# EAGLE design board (EAGLE 7.7.0)

## Sheet 1 of 2
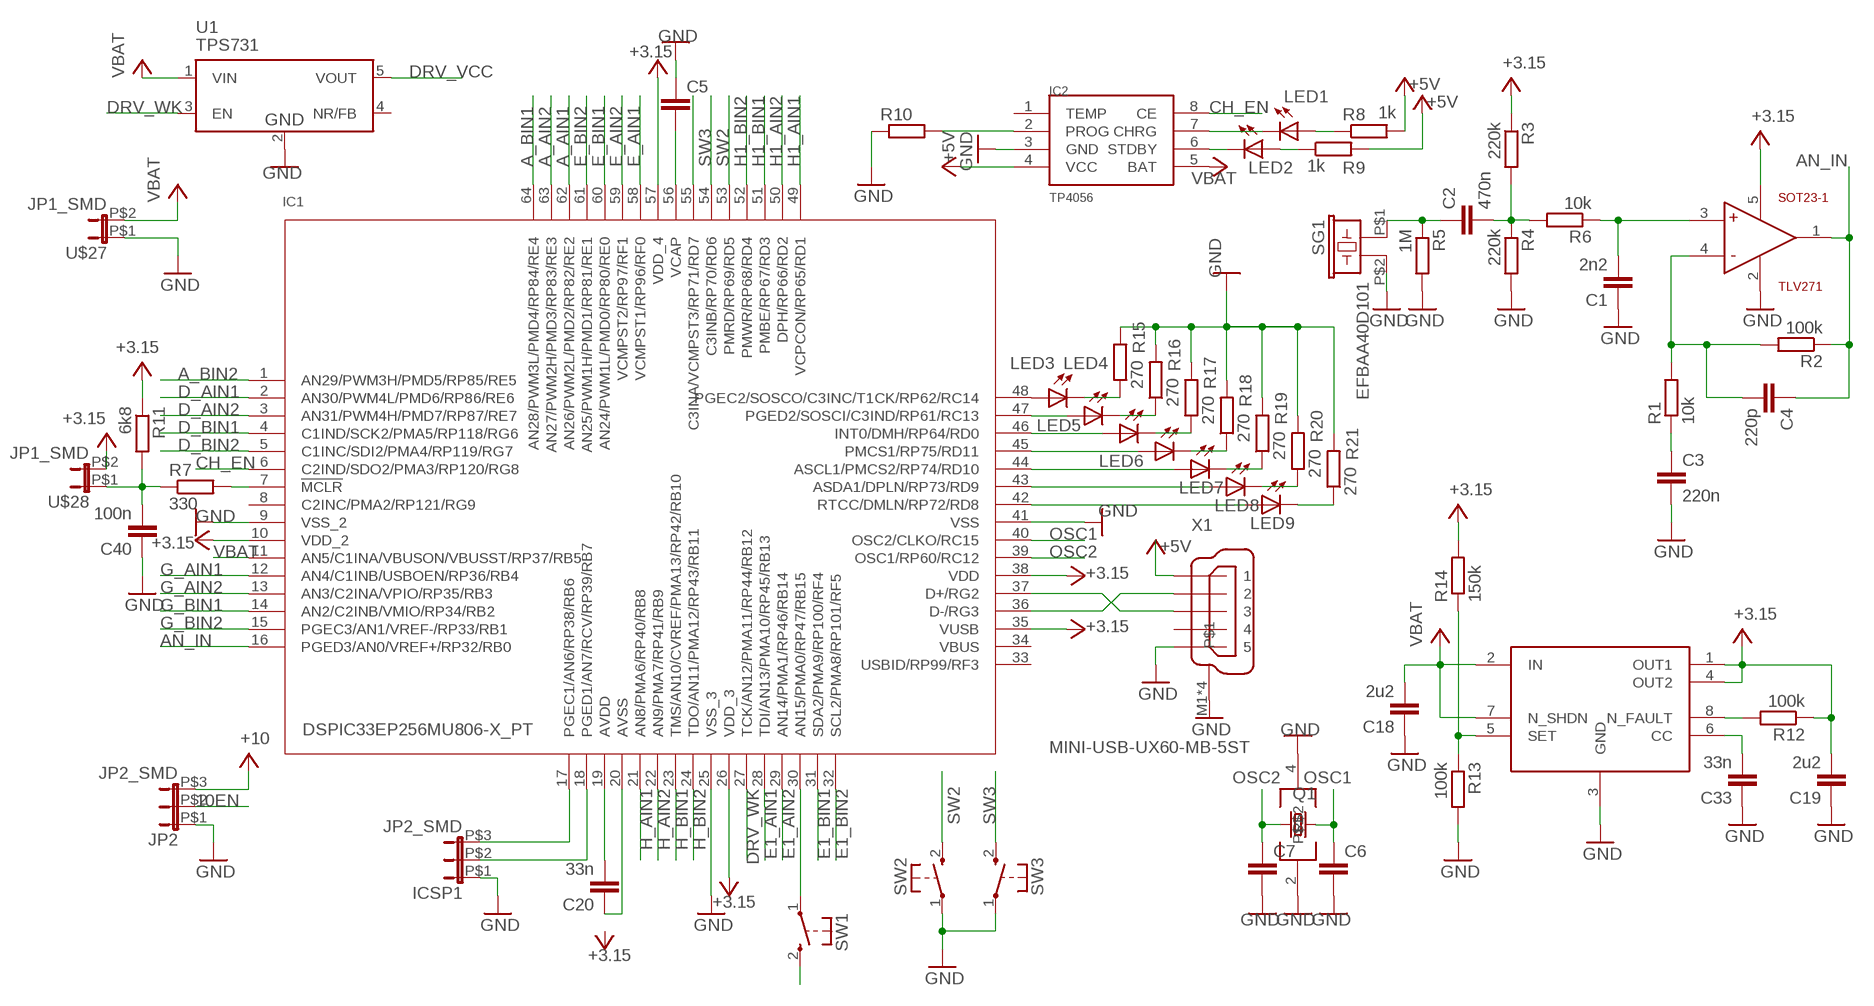
[diagram p0: schematic, sheet 1]

### Parts
C1  2n2  C  [C0805]
C2  470n  C  [C0805]
C3  220n  CC1206  [C1206]
C4  220p  C  [C0805]
C5  CC1206  [C1206]
C6  C  [C0805]
C7  C  [C0805]
C18  2u2  C  [C0805]
C19  2u2  C  [C0805]
C20  33n  C  [C0805]
C33  33n  C  [C0805]
C40  100n  CC0603  [C0603]
IC1  DSPIC33EP256MU806-X_PT  [QFP64-10X10MC]
IC2  TP4056  [SOP-8]
ICSP1  JP2_SMD  [JP2_SMD]
JP2  JP2_SMD  [JP2_SMD]
LED1  LED_ESML0603  [LED_SML0603]
LED2  LED_ESML0603  [LED_SML0603]
LED3  LED_ESML0603  [LED_SML0603]
LED4  LED_ESML0603  [LED_SML0603]
LED5  LED_ESML0603  [LED_SML0603]
LED6  LED_ESML0603  [LED_SML0603]
LED7  LED_ESML0603  [LED_SML0603]
LED8  LED_ESML0603  [LED_SML0603]
LED9  LED_ESML0603  [LED_SML0603]
Q1  CRYSTALCTS406  [CTS406]
R1  10k  R  [R0805]
R2  100k  R  [R0805]
R3  220k  R  [R0805]
R4  220k  R  [R0805]
R5  1M  R  [R0805]
R6  10k  R  [R0805]
R7  330  RR0603  [R0603]
R8  1k  R  [R0805]
R9  1k  R  [R0805]
R10  R  [R0805]
R11  6k8  RR0603  [R0603]
R12  100k  R  [R0805]
R13  100k  R  [R0805]
R14  150k  R  [R0805]
R15  270  R  [R0805]
R16  270  R  [R0805]
R17  270  R  [R0805]
R18  270  R  [R0805]
R19  270  R  [R0805]
R20  270  R  [R0805]
R21  270  R  [R0805]
SG1  EFBAA40D101  [EFBAA40D101]
SOT23-1  TLV271  [SOT23-5]
SW1  KSS-2EG4430  [KSS-2EG4430]
SW2  KSS-2EG4430  [KSS-2EG4430]
SW3  KSS-2EG4430  [KSS-2EG4430]
U1  TPS731  [SOT25]
U$8  LP3982  [LP3982]
U$27  JP1_SMD  [JP1_SMD]
U$28  JP1_SMD  [JP1_SMD]
X1  MINI-USB-UX60-MB-5ST  [UX60-MB-5ST]

### Nets
10EN: IC1.55(C3INA/VCMPST3/RP71/RD7) JP2.P$2
+3.15: R11.1 U$28.P$2
+3.15V: C19.2 IC1.10(VDD_2) IC1.26(VDD_3) IC1.35(VUSB) IC1.38(VDD) IC1.57(VDD_4) R3.1 R12.1 R14.2 SOT23-1.5(VDD) U$8.1(OUT1) U$8.4(OUT2) ; supply symbol labelled +3.15 ; also sheet 2
+5V: IC2.4(VCC) R8.2 R9.2 X1.1 ; also sheet 2
+10V: JP2.P$3 ; supply symbol labelled +10 ; also sheet 2
A_AIN1 [diffPair]: IC1.62(AN26/PWM2L/PMD2/RP82/RE2) ; also sheet 2
A_AIN2 [diffPair]: IC1.63(AN27/PWM2H/PMD3/RP83/RE3) ; also sheet 2
A_BIN1 [diffPair]: IC1.64(AN28/PWM3L/PMD4/RP84/RE4) ; also sheet 2
A_BIN2 [diffPair]: IC1.1(AN29/PWM3H/PMD5/RP85/RE5) ; also sheet 2
AN_IN: C4.1 IC1.16(PGED3/AN0/VREF+/RP32/RB0) R2.1 SOT23-1.1(OUT)
CH_EN: IC1.6(C2IND/SDO2/PMA3/RP120/RG8) IC2.8(CE)
D_AIN1: IC1.2(AN30/PWM4L/PMD6/RP86/RE6) ; also sheet 2
D_AIN2: IC1.3(AN31/PWM4H/PMD7/RP87/RE7) ; also sheet 2
D_BIN1: IC1.4(C1IND/SCK2/PMA5/RP118/RG6) ; also sheet 2
D_BIN2: IC1.5(C1INC/SDI2/PMA4/RP119/RG7) ; also sheet 2
DIFF_NS: IC1.36(D-/RG3) X1.2
DIFF_PD: IC1.37(D+/RG2) X1.3
DRV_VCC: U1.5(VOUT) ; also sheet 2
DRV_WK: IC1.27(TCK/AN12/PMA11/RP44/RB12) U1.3(EN)
E1_AIN1: IC1.28(TDI/AN13/PMA10/RP45/RB13) ; also sheet 2
E1_AIN2: IC1.29(AN14/PMA1/RP46/RB14) ; also sheet 2
E1_BIN1: IC1.31(SDA2/PMA9/RP100/RF4) ; also sheet 2
E1_BIN2: IC1.32(SCL2/PMA8/RP101/RF5) ; also sheet 2
E_AIN1: IC1.58(VCMPST1/RP96/RF0) ; also sheet 2
E_AIN2: IC1.59(VCMPST2/RP97/RF1) ; also sheet 2
E_BIN1: IC1.60(AN24/PWM1L/PMD0/RP80/RE0) ; also sheet 2
E_BIN2: IC1.61(AN25/PWM1H/PMD1/RP81/RE1) ; also sheet 2
FGH [diffPair]: IC1.17(PGEC1/AN6/RP38/RB6) ICSP1.P$3
G_AIN1: IC1.12(AN4/C1INB/USBOEN/RP36/RB4) ; also sheet 2
G_AIN2: IC1.13(AN3/C2INA/VPIO/RP35/RB3) ; also sheet 2
G_BIN1: IC1.14(AN2/C2INB/VMIO/RP34/RB2) ; also sheet 2
G_BIN2: IC1.15(PGEC3/AN1/VREF-/RP33/RB1) ; also sheet 2
GFD [diffPair]: IC1.18(PGED1/AN7/RCV/RP39/RB7) ICSP1.P$2
GND: C1.1 C3.2 C5.1 C6.2 C7.2 C18.1 C19.1 C33.1 C40.1 IC1.9(VSS_2) IC1.25(VSS_3) IC1.41(VSS) IC2.3(GND) ICSP1.P$1 JP2.P$1 Q1.2 Q1.4 R4.2 R5.2 R10.1 R13.2 R15.2 R16.2 R17.2 R18.2 R19.2 R20.2 R21.2 SG1.P$2 SOT23-1.2(GND) SW2.1(P) SW3.1(P) U1.2(GND) U$8.3(GND) U$27.P$1 X1.5 X1.M1 X1.M2 X1.M3 X1.M4 ; also sheet 2
H1_AIN1: IC1.49(VCPCON/RP65/RD1) ; also sheet 2
H1_AIN2: IC1.50(DPH/RP66/RD2) ; also sheet 2
H1_BIN1: IC1.51(PMBE/RP67/RD3) ; also sheet 2
H1_BIN2: IC1.52(PMWR/RP68/RD4) ; also sheet 2
H_AIN1: IC1.21(AN8/PMA6/RP40/RB8) ; also sheet 2
H_AIN2: IC1.22(AN9/PMA7/RP41/RB9) ; also sheet 2
H_BIN1: IC1.23(TMS/AN10/CVREF/PMA13/RP42/RB10) ; also sheet 2
H_BIN2: IC1.24(TDO/AN11/PMA12/RP43/RB11) ; also sheet 2
N$1: SW1.2(S)
N$3: C20.2 IC1.19(AVDD)
N$4: C20.1 IC1.20(AVSS)
N$5: IC1.7(!MCLR) R7.2
N$6: C5.2 IC1.56(VCAP)
N$11: IC1.48(PGEC2/SOSCO/C3INC/T1CK/RP62/RC14) LED3.A
N$12: C4.2 R1.2 R2.2 SOT23-1.4(IN-)
N$13: C3.1 R1.1
N$14: C2.2 R3.2 R4.1 R6.2
N$15: IC2.7(CHRG) LED1.C
N$16: C2.1 R5.1 SG1.P$1
N$21: IC2.6(STDBY) LED2.C
N$22: LED2.A R9.1
N$23: LED1.A R8.1
N$24: IC2.2(PROG) R10.2
N$25: C1.2 R6.1 SOT23-1.3(IN+)
N$26: R12.2 U$8.8(N_FAULT)
N$31: C33.2 U$8.6(CC)
N$32: IC1.47(PGED2/SOSCI/C3IND/RP61/RC13) LED4.A
N$33: R13.1 R14.1 U$8.5(SET)
N$34: IC1.46(INT0/DMH/RP64/RD0) LED5.A
N$42: IC1.45(PMCS1/RP75/RD11) LED6.A
N$43: IC1.44(ASCL1/PMCS2/RP74/RD10) LED7.A
N$44: IC1.43(ASDA1/DPLN/RP73/RD9) LED8.A
N$45: IC1.42(RTCC/DMLN/RP72/RD8) LED9.A
N$46: LED9.C R21.1
N$51: LED8.C R20.1
N$52: LED7.C R19.1
N$53: LED6.C R18.1
N$54: LED5.C R17.1
N$55: LED4.C R16.1
N$56: LED3.C R15.1
N$62: IC1.30(AN15/PMA0/RP47/RB15) SW1.1(P)
OSC1: C6.1 IC1.40(OSC2/CLKO/RC15) Q1.1
OSC2: C7.1 IC1.39(OSC1/RP60/RC12) Q1.3
RST: C40.2 R7.1 R11.2 U$28.P$1
SW2: IC1.53(PMRD/RP69/RD5) SW2.2(S)
SW3: IC1.54(C3INB/RP70/RD6) SW3.2(S)
VBAT: C18.2 IC1.11(AN5/C1INA/VBUSON/VBUSST/RP37/RB5) IC2.5(BAT) U1.1(VIN) U$8.2(IN) U$8.7(N_SHDN) U$27.P$2 ; also sheet 2
Unconnected: IC1.8(C2INC/PMA2/RP121/RG9) IC1.33(USBID/RP99/RF3) IC2.1(TEMP) U1.4(NR/FB) X1.4

## Sheet 2 of 2
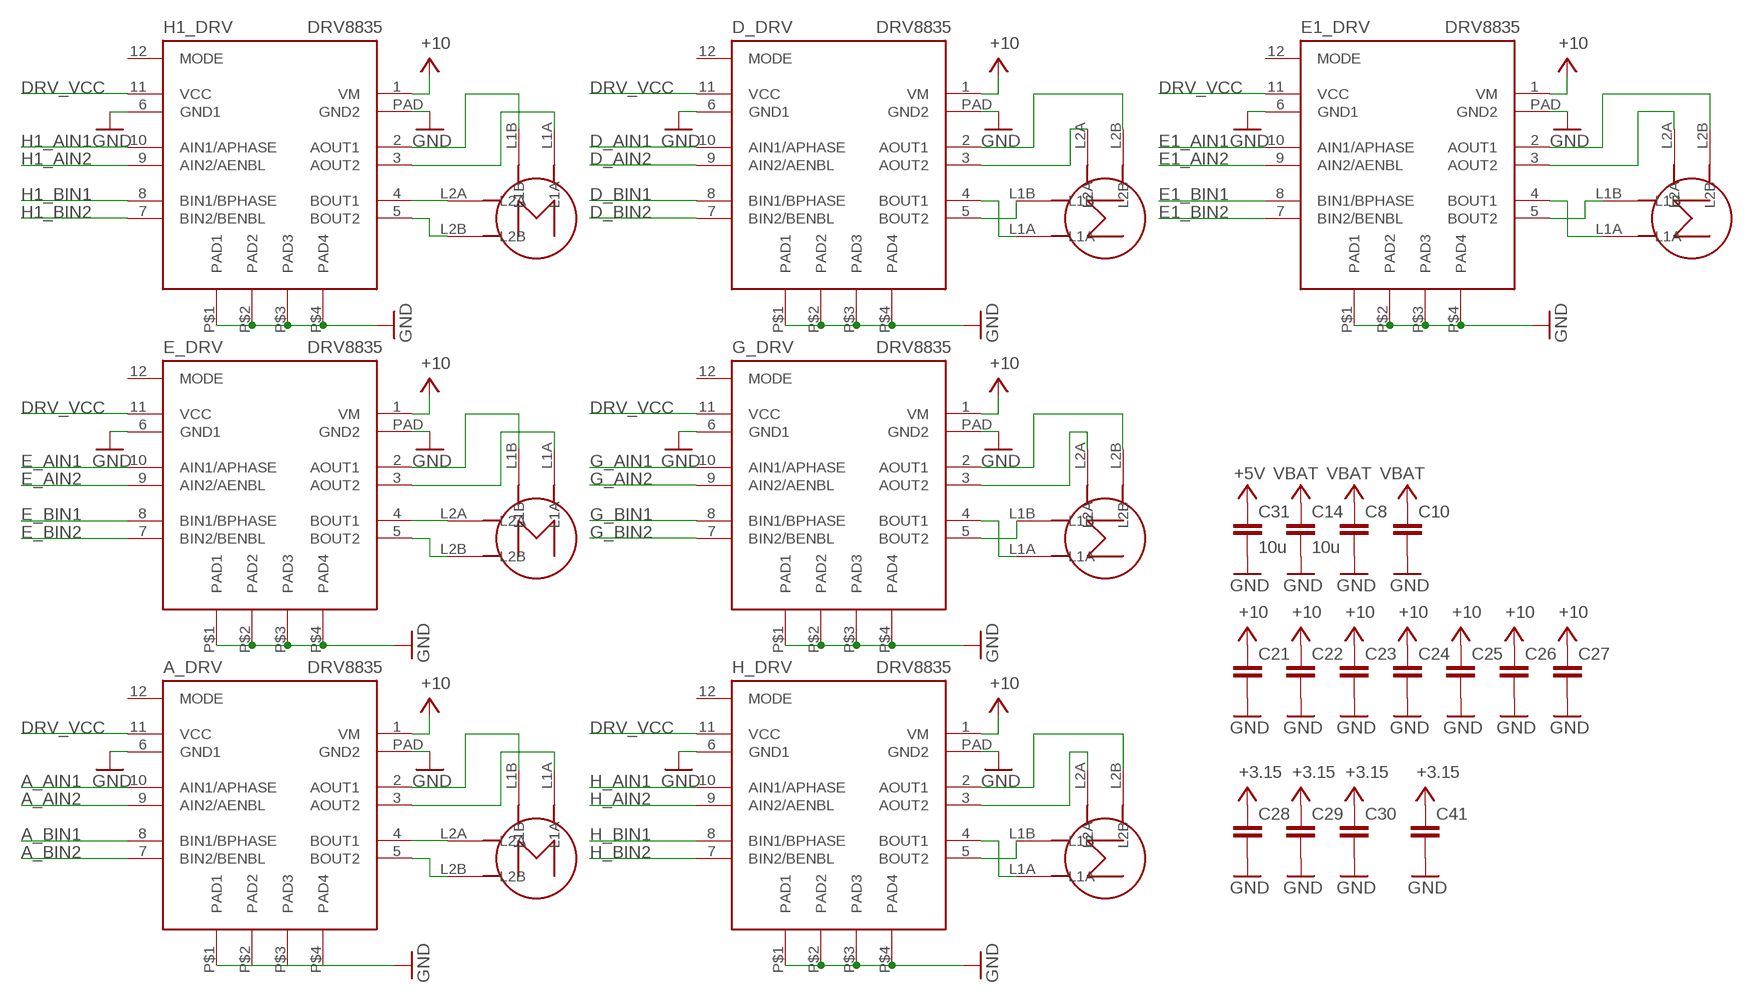
[diagram p1: schematic, sheet 2]

### Parts
A_DRV  DRV8835  [WSON_2X3]
C8  CC1206  [C1206]
C10  CC1206  [C1206]
C14  10u  CC1206  [C1206]
C21  CC1206  [C1206]
C22  CC1206  [C1206]
C23  CC1206  [C1206]
C24  CC1206  [C1206]
C25  CC1206  [C1206]
C26  CC1206  [C1206]
C27  CC1206  [C1206]
C28  CC1206  [C1206]
C29  CC1206  [C1206]
C30  CC1206  [C1206]
C31  10u  CC1206  [C1206]
C41  CC1206  [C1206]
D_DRV  DRV8835  [WSON_2X3]
E1_DRV  DRV8835  [WSON_2X3]
E_DRV  DRV8835  [WSON_2X3]
G_DRV  DRV8835  [WSON_2X3]
H1_DRV  DRV8835  [WSON_2X3]
H1šWF  H1  STEP_MOTOR  [STEP_MOTOR]
H_DRV  DRV8835  [WSON_2X3]
U$1  STEP_MOTOR_MIRROR  [STEP_MOTOR_MIRROR]
U$2  STEP_MOTOR_MIRROR  [STEP_MOTOR_MIRROR]
U$3  STEP_MOTOR_MIRROR  [STEP_MOTOR_MIRROR]
U$4  STEP_MOTOR  [STEP_MOTOR]
U$6  STEP_MOTOR  [STEP_MOTOR]
U$7  STEP_MOTOR_MIRROR  [STEP_MOTOR_MIRROR]

### Nets
+3.15V: C28.1 C29.1 C30.1 C41.1 ; supply symbol labelled +3.15 ; also sheet 1
+5V: C31.1 ; also sheet 1
+10V: A_DRV.1(VM) C21.1 C22.1 C23.1 C24.1 C25.1 C26.1 C27.1 D_DRV.1(VM) E1_DRV.1(VM) E_DRV.1(VM) G_DRV.1(VM) H1_DRV.1(VM) H_DRV.1(VM) ; supply symbol labelled +10 ; also sheet 1
A_AIN1 [diffPair]: A_DRV.10(AIN1/APHASE) ; also sheet 1
A_AIN2 [diffPair]: A_DRV.9(AIN2/AENBL) ; also sheet 1
A_BIN1 [diffPair]: A_DRV.8(BIN1/BPHASE) ; also sheet 1
A_BIN2 [diffPair]: A_DRV.7(BIN2/BENBL) ; also sheet 1
D_AIN1: D_DRV.10(AIN1/APHASE) ; also sheet 1
D_AIN2: D_DRV.9(AIN2/AENBL) ; also sheet 1
D_BIN1: D_DRV.8(BIN1/BPHASE) ; also sheet 1
D_BIN2: D_DRV.7(BIN2/BENBL) ; also sheet 1
DRV_VCC: A_DRV.11(VCC) D_DRV.11(VCC) E1_DRV.11(VCC) E_DRV.11(VCC) G_DRV.11(VCC) H1_DRV.11(VCC) H_DRV.11(VCC) ; also sheet 1
E1_AIN1: E1_DRV.10(AIN1/APHASE) ; also sheet 1
E1_AIN2: E1_DRV.9(AIN2/AENBL) ; also sheet 1
E1_BIN1: E1_DRV.8(BIN1/BPHASE) ; also sheet 1
E1_BIN2: E1_DRV.7(BIN2/BENBL) ; also sheet 1
E_AIN1: E_DRV.10(AIN1/APHASE) ; also sheet 1
E_AIN2: E_DRV.9(AIN2/AENBL) ; also sheet 1
E_BIN1: E_DRV.8(BIN1/BPHASE) ; also sheet 1
E_BIN2: E_DRV.7(BIN2/BENBL) ; also sheet 1
G_AIN1: G_DRV.10(AIN1/APHASE) ; also sheet 1
G_AIN2: G_DRV.9(AIN2/AENBL) ; also sheet 1
G_BIN1: G_DRV.8(BIN1/BPHASE) ; also sheet 1
G_BIN2: G_DRV.7(BIN2/BENBL) ; also sheet 1
GND: A_DRV.6(GND1) A_DRV.P$1(PAD1) A_DRV.PAD(GND2) C8.2 C10.2 C14.2 C21.2 C22.2 C23.2 C24.2 C25.2 C26.2 C27.2 C28.2 C29.2 C30.2 C31.2 C41.2 D_DRV.6(GND1) D_DRV.P$1(PAD1) D_DRV.P$2(PAD2) D_DRV.P$3(PAD3) D_DRV.P$4(PAD4) D_DRV.PAD(GND2) E1_DRV.6(GND1) E1_DRV.P$1(PAD1) E1_DRV.P$2(PAD2) E1_DRV.P$3(PAD3) E1_DRV.P$4(PAD4) E1_DRV.PAD(GND2) E_DRV.6(GND1) E_DRV.P$1(PAD1) E_DRV.P$2(PAD2) E_DRV.P$3(PAD3) E_DRV.P$4(PAD4) E_DRV.PAD(GND2) G_DRV.6(GND1) G_DRV.P$1(PAD1) G_DRV.P$2(PAD2) G_DRV.P$3(PAD3) G_DRV.P$4(PAD4) G_DRV.PAD(GND2) H1_DRV.6(GND1) H1_DRV.P$1(PAD1) H1_DRV.P$2(PAD2) H1_DRV.P$3(PAD3) H1_DRV.P$4(PAD4) H1_DRV.PAD(GND2) H_DRV.6(GND1) H_DRV.P$1(PAD1) H_DRV.P$2(PAD2) H_DRV.P$3(PAD3) H_DRV.P$4(PAD4) H_DRV.PAD(GND2) ; also sheet 1
H1_AIN1: H1_DRV.10(AIN1/APHASE) ; also sheet 1
H1_AIN2: H1_DRV.9(AIN2/AENBL) ; also sheet 1
H1_BIN1: H1_DRV.8(BIN1/BPHASE) ; also sheet 1
H1_BIN2: H1_DRV.7(BIN2/BENBL) ; also sheet 1
H_AIN1: H_DRV.10(AIN1/APHASE) ; also sheet 1
H_AIN2: H_DRV.9(AIN2/AENBL) ; also sheet 1
H_BIN1: H_DRV.8(BIN1/BPHASE) ; also sheet 1
H_BIN2: H_DRV.7(BIN2/BENBL) ; also sheet 1
N$7: D_DRV.2(AOUT1) U$2.L2B
N$8: D_DRV.3(AOUT2) U$2.L2A
N$9: D_DRV.5(BOUT2) U$2.L1B
N$10: D_DRV.4(BOUT1) U$2.L1A
N$17: E1_DRV.2(AOUT1) U$1.L2B
N$18: E1_DRV.3(AOUT2) U$1.L2A
N$19: E1_DRV.4(BOUT1) U$1.L1A
N$20: E1_DRV.5(BOUT2) U$1.L1B
N$27: G_DRV.2(AOUT1) U$3.L2B
N$28: G_DRV.3(AOUT2) U$3.L2A
N$29: G_DRV.5(BOUT2) U$3.L1B
N$30: G_DRV.4(BOUT1) U$3.L1A
N$35: E_DRV.5(BOUT2) U$4.L2B
N$36: H_DRV.4(BOUT1) U$7.L1A
N$37: E_DRV.2(AOUT1) U$4.L1B
N$38: E_DRV.3(AOUT2) U$4.L1A
N$40: E_DRV.4(BOUT1) U$4.L2A
N$41: A_DRV.5(BOUT2) U$6.L2B
N$47: H1_DRV.2(AOUT1) H1šWF.L1B
N$48: H1_DRV.3(AOUT2) H1šWF.L1A
N$49: H1_DRV.5(BOUT2) H1šWF.L2B
N$50: H1_DRV.4(BOUT1) H1šWF.L2A
N$57: A_DRV.2(AOUT1) U$6.L1B
N$58: A_DRV.3(AOUT2) U$6.L1A
N$60: A_DRV.4(BOUT1) U$6.L2A
N$67: H_DRV.2(AOUT1) U$7.L2B
N$68: H_DRV.3(AOUT2) U$7.L2A
N$69: H_DRV.5(BOUT2) U$7.L1B
VBAT: C8.1 C10.1 C14.1 ; also sheet 1
Unconnected: A_DRV.12(MODE) A_DRV.P$2(PAD2) A_DRV.P$3(PAD3) A_DRV.P$4(PAD4) D_DRV.12(MODE) E1_DRV.12(MODE) E_DRV.12(MODE) G_DRV.12(MODE) H1_DRV.12(MODE) H_DRV.12(MODE)

## Power pins joined to a net without a drawn wire
VBUS: IC1.34(VBUS)

## Library data of the parts
A_DRV D_DRV E1_DRV E_DRV G_DRV H1_DRV H_DRV = bt_motordriver:DRV8835: DRV8835 DUAL LOW VOLTAGE H-BRIDGE IC The DRV8835 provides an integrated motor driver solution for cameras, consumer products, toys, and other low voltage or battery-powered motion control applications. The device has two H-bridge drivers, and can drive two DC motors or one stepper motor, as well as other devices like solenoids. The device has two H-bridge drivers, and drives two DC motors or one stepper motor, as well as other devices like solenoids. The output driver block for each consists of N-channel power MOSFETs configured as an H-bridge to drive the motor winding. An internal charge pump generates gate drive voltages. 1.5-A Maximum Drive Current Per H-Bridge Configure Bridges Parallel for 3-A Drive Curren 0-V to 11-V Motor-Operating Supply-Voltage 2-V to 7-V Logic Supply-Voltage Flexible PWM or PHASE/ENABLE Interface Low-Power Sleep Mode With 95-nA Maximum Supply Current Tiny 2.00-mm × 3.00-mm WSON Package Reference: http://www.ti.com/lit/ds/symlink/drv8835.pdf
C1-C8 C10 C14 C18-C31 C33 C40 C41 = eagle-ltspice:C: CAPACITOR, European symbol; SPICEMODEL: NONE; SPICEPREFIX: C
H1šWF U$4 U$6 = diplomka:STEP_MOTOR
IC1 = dspic33ep:DSPIC33EP256MU806-X_PT: dsPIC33EP256MU806-X_PT QFP64 10x10
IC2 = TP4056.lbr:TP4056
ICSP1 JP2 = jumper:JP2_SMD
LED1-LED9 = eagle-ltspice:LED_E: LED Source: http://www.osram.convergy.de Source: www.luxeon.com Source: www.kingbright.com; SPICEMODEL: NONE; SPICEPREFIX: D; SPICETYPE: diode
Q1 = crystal:CRYSTAL: CRYSTAL; OC_FARNELL: unknown; OC_NEWARK: unknown
R1-R21 = eagle-ltspice:R: RESISTOR, European symbol; SPICEMODEL: NONE; SPICEPREFIX: R
SG1 = buzzer:EFB?: Piezoelectric Acoustic Transducer Source: Panbasonic .. 2SC1685.pdf; OC_FARNELL: unknown; OC_NEWARK: unknown
SOT23-1 = texas_instruments:TLV271: TLV271 Single channel 3mhz Op-Amp
SW1-SW3 = buttons:KSS-2EG4430: Size: 3x6mm Height: 5mm from PCB Rating: DC12v 50mA Travel: 0.25±0.10mm Operating Force: 180±50gf Return Force: 60gf min Contact resistance: 100m? max Insulation resistance: 100M? min Operating life?50,000 cycles
U1 = TPS731xx:TPS731*
U$1-U$3 U$7 = diplomka:STEP_MOTOR_MIRROR
U$8 = diplomka2:LP3982
U$27 U$28 = jumper:JP1_SMD
X1 = con-hirose:MINI-USB-: MINI USB Connector Source: http://www.hirose.co.jp/cataloge_hp/e24000019.pdf; OC_FARNELL: unknown; OC_NEWARK: unknown

## Net classes
0 default: width 0.15 mm, drill 0.3 mm, clearance 0.15 mm
1 diffPair: width 0.15 mm, drill 0.3 mm, clearance 0.15 mm

## Board
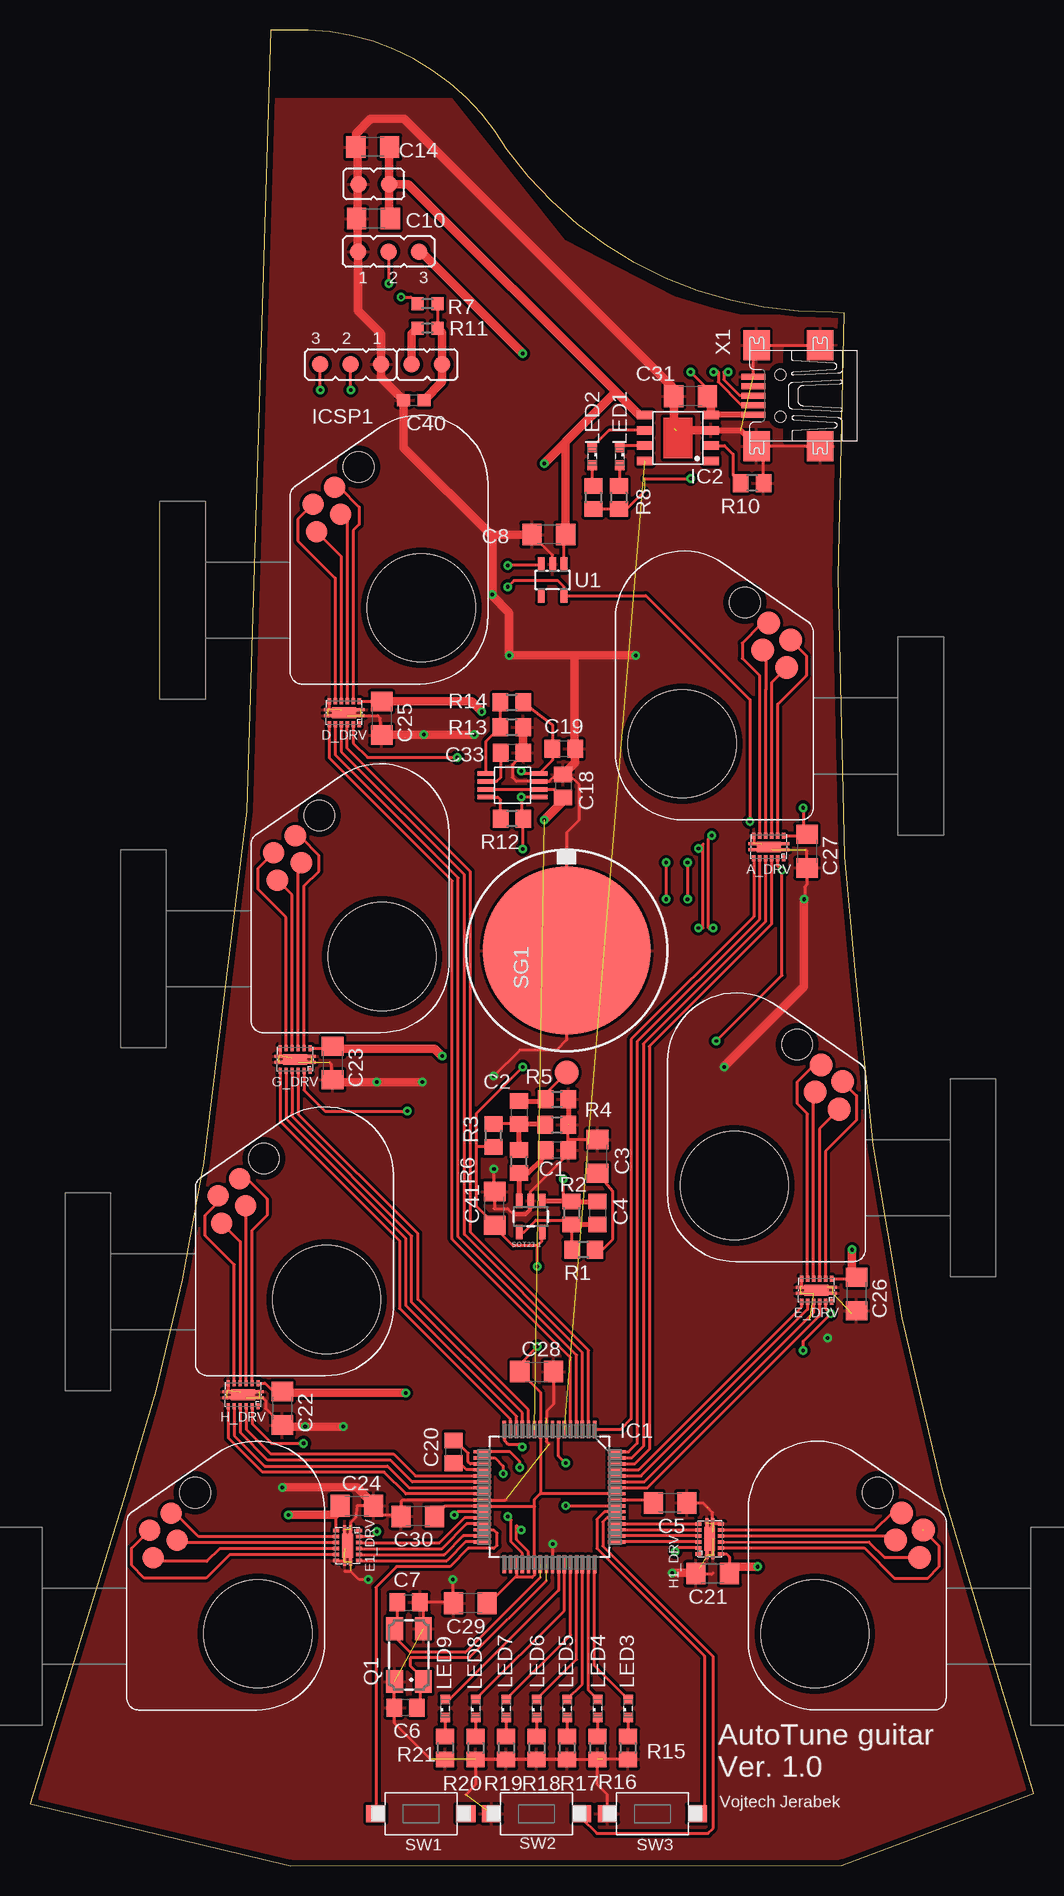
[diagram p2: board, top side]
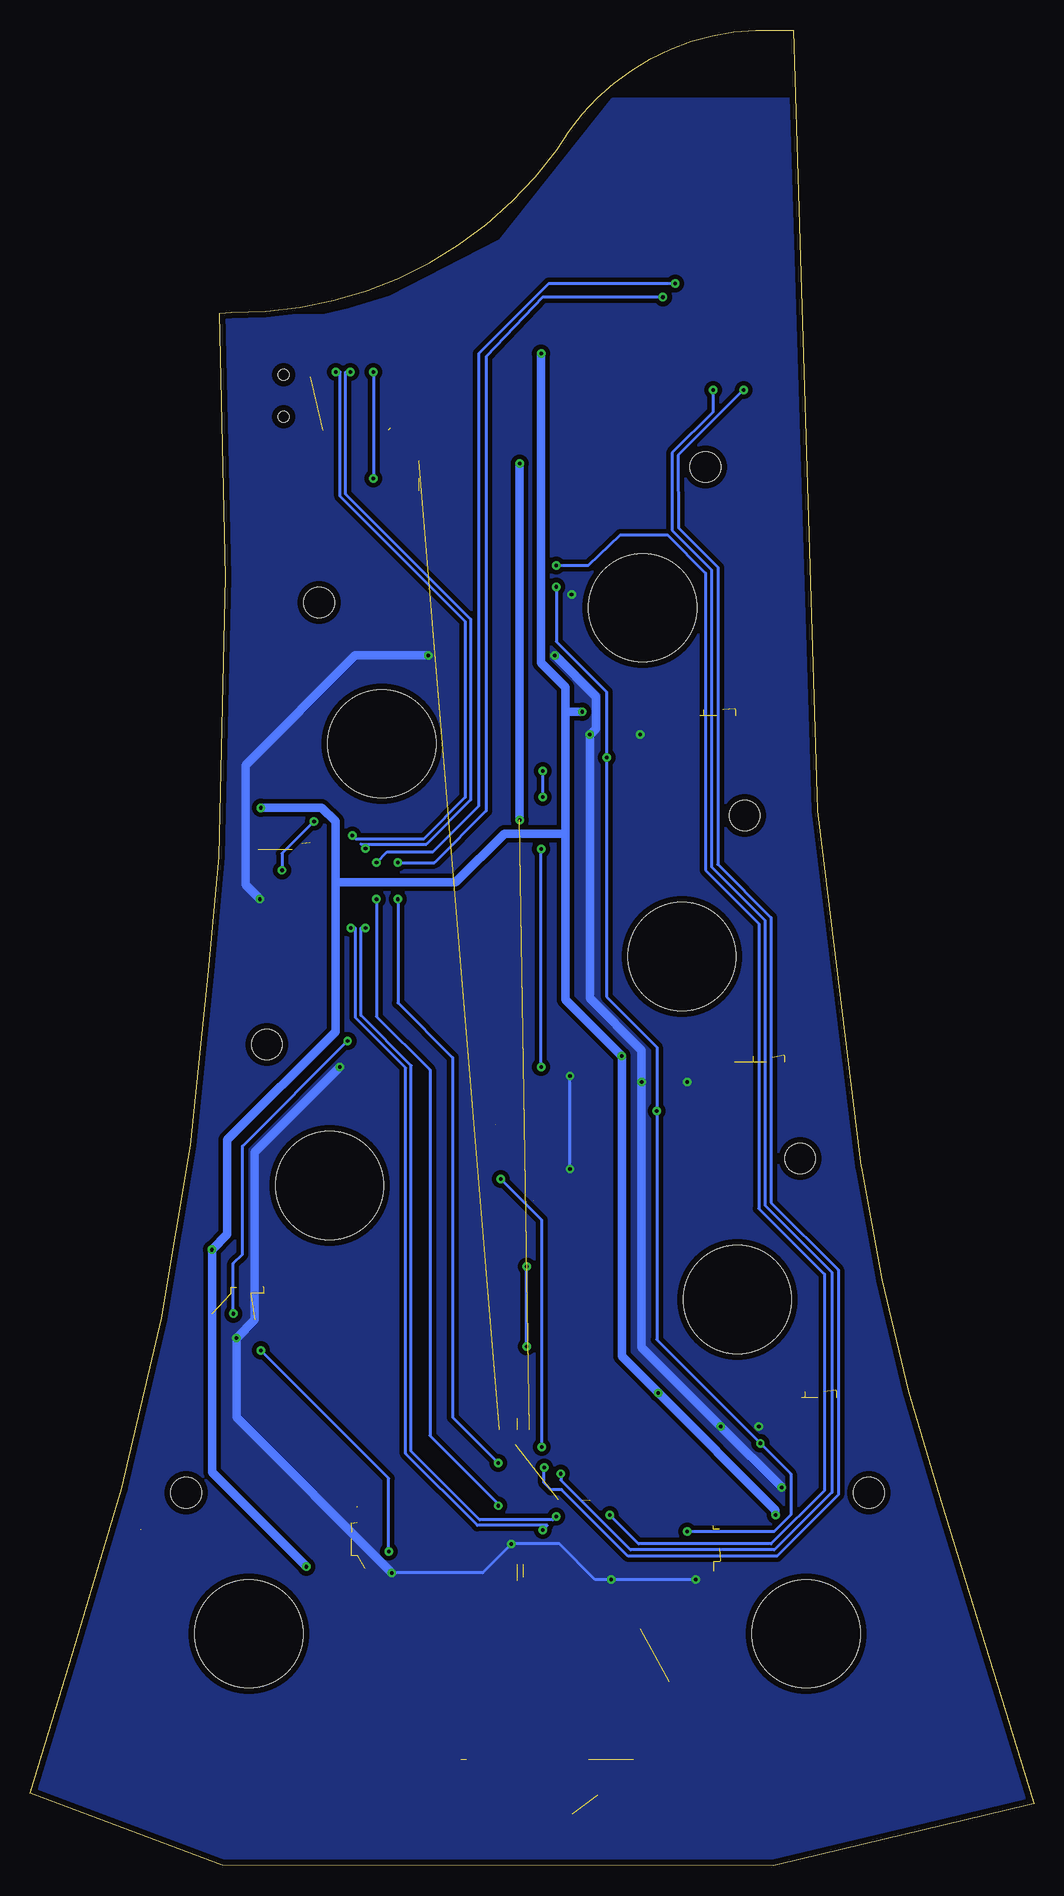
[diagram p3: board, bottom side, seen from below]

Size 83.71 x 152.97 mm. Coordinates in mm from the lower left corner, seen from the top.
Outline: 0,5.14 21.71,0 67.7,0.05 83.7,6.02 83.71,6.02 80.24,17.4 arc-14 68.83,74.56 67.95,84.08 67.41,107.43 67.9,129.36 66.92,129.46 arc-55 39.76,143.01 arc63 21.36,152.96 20.06,152.94 18.06,87.9 14.42,58.28 14.39,58.22 arc-9 7.77,30.39 0.01,5.2 0,5.14
Copper layers (1*16): Top 0.035mm / dielectric 1.5mm / Bottom 0.035mm
Design rules "default *": minimum track width 10mil, minimum drill 10mil, track to track 0.15mm, track to pad 0.15mm, pad to pad 0.15mm, via to via 0.15mm, smd to smd 0.15mm, copper to edge 20mil, drill to drill 8mil, minimum pad ring 10mil, minimum via ring 8mil, stop-mask expansion 2mil, vias tented up to drill 15mil, thermal gap 10mil

### Footprints (pad centres in the part's own frame; a part is rotated, then mirrored left to right if it is on the bottom)
WSON_2X3 = smd 0.28 x 0.5: 1 -1.25,-0.95; 2 -0.75,-0.95; 3 -0.25,-0.95; 4 0.25,-0.95; 5 0.75,-0.95; 6 1.25,-0.95; 7 1.25,0.95; 8 0.75,0.95; 9 0.25,0.95; 10 -0.25,0.95; 11 -0.75,0.95; 12 -1.25,0.95 | smd 0.7 x 0.25: P$1 -1.35,0.25; P$2 -1.35,-0.25; P$3 1.35,-0.25; P$4 1.35,0.25 | smd 2 x 0.9: PAD 0,0
C0805 = smd 1.3 x 1.5: 1 -0.95,0; 2 0.95,0
C1206 = smd 1.6 x 1.8: 1 -1.4,0; 2 1.4,0
C0603 = smd 1.1 x 1: 1 -0.85,0; 2 0.85,0
STEP_MOTOR = smd 1.93 x 1.93: L1A 6.35,-8.73; L1B 8.65,-9.03; L2A 7.8,-6.73; L2B 10.05,-7.23 | hole 9: 0,0 | hole 2.54: 11.75,-5.23
QFP64-10X10MC = smd 1.473 x 0.279: 1 -5.613,3.759; 2 -5.613,3.251; 3 -5.613,2.743; 4 -5.613,2.261; 5 -5.613,1.753; 6 -5.613,1.245; 7 -5.613,0.762; 8 -5.613,0.254; 9 -5.613,-0.254; 10 -5.613,-0.762; 11 -5.613,-1.245; 12 -5.613,-1.753; 13 -5.613,-2.261; 14 -5.613,-2.743; 15 -5.613,-3.251; 16 -5.613,-3.759; 33 5.613,-3.759; 34 5.613,-3.251; 35 5.613,-2.743; 36 5.613,-2.261; 37 5.613,-1.753; 38 5.613,-1.245; 39 5.613,-0.762; 40 5.613,-0.254; 41 5.613,0.254; 42 5.613,0.762; 43 5.613,1.245; 44 5.613,1.753; 45 5.613,2.261; 46 5.613,2.743; 47 5.613,3.251; 48 5.613,3.759 | smd 0.279 x 1.473: 17 -3.759,-5.613; 18 -3.251,-5.613; 19 -2.743,-5.613; 20 -2.261,-5.613; 21 -1.753,-5.613; 22 -1.245,-5.613; 23 -0.762,-5.613; 24 -0.254,-5.613; 25 0.254,-5.613; 26 0.762,-5.613; 27 1.245,-5.613; 28 1.753,-5.613; 29 2.261,-5.613; 30 2.743,-5.613; 31 3.251,-5.613; 32 3.759,-5.613; 49 3.759,5.613; 50 3.251,5.613; 51 2.743,5.613; 52 2.261,5.613; 53 1.753,5.613; 54 1.245,5.613; 55 0.762,5.613; 56 0.254,5.613; 57 -0.254,5.613; 58 -0.762,5.613; 59 -1.245,5.613; 60 -1.753,5.613; 61 -2.261,5.613; 62 -2.743,5.613; 63 -3.251,5.613; 64 -3.759,5.613
SOP-8 = smd 1.3 x 0.7: 1 -2.75,1.905; 2 -2.75,0.635; 3 -2.75,-0.635; 4 -2.75,-1.905; 5 2.75,-1.905; 6 2.75,-0.635; 7 2.75,0.635; 8 2.75,1.905
JP2_SMD = smd 1.397 x 1.397: P$1 -2.54,0; P$2 0,0; P$3 2.54,0
LED_SML0603 = smd 0.8 x 0.8: A 0.75,0; C -0.75,0
CTS406 = smd 1.9 x 1.4: 1 -2.2,-1.2; 2 2.2,-1.2; 3 2.2,1.2; 4 -2.2,1.2
R0805 = smd 1.3 x 1.5: 1 -0.95,0; 2 0.95,0
R0603 = smd 1 x 1.1: 1 -0.85,0; 2 0.85,0
EFBAA40D101 = smd 2 x 2: P$1 -10.16,0 | smd 14 x 14: P$2 0,0
SOT23-5 = smd 0.55 x 1.2: 1 0.32,1.24; 2 1.27,1.24; 3 2.22,1.24; 4 2.22,3.84; 5 0.32,3.84
KSS-2EG4430 = smd 1.6 x 1.4: 1 -3.75,0; 2 3.75,0
SOT25 = smd 0.55 x 1.2: 1 -0.95,-1.3; 2 0,-1.3; 3 0.95,-1.3; 4 0.95,1.3; 5 -0.95,1.3
STEP_MOTOR_MIRROR = smd 1.778 x 1.778: L1A -6.35,-8.73; L1B -8.65,-9.03; L2A -7.8,-6.73; L2B -10.05,-7.23 | hole 2.54: -11.75,-5.23 | hole 9: 0,0
LP3982 = smd 1.45 x 0.38: 1 -2.2,0.975; 2 -2.2,0.325; 3 -2.2,-0.325; 4 -2.2,-0.975; 5 2.2,-0.975; 6 2.2,-0.325; 7 2.2,0.325; 8 2.2,0.975
JP1_SMD = smd 1.397 x 1.397: P$1 0,-1.27; P$2 0,1.27
UX60-MB-5ST = smd 2 x 0.5: 1 2.25,1.6; 2 2.25,0.8; 3 2.25,0; 4 2.25,-0.8; 5 2.25,-1.6 | smd 2.2 x 2.5: M1 -3.3,-4.2; M2 -3.3,4.2; M3 2,4.2; M4 2,-4.2 | hole 0.9: 0,-1.75; 0,1.75

### Placement (x,y rotation side)
A_DRV  61.6,84.89 180 top
C1  43.94,59.62 180 top
C2  40.78,62.76 270 top
C3  47.31,59.11 90 top
C4  47.3,54.39 270 top
C5  53.37,30.23 180 top
C6  31.31,13.17 180 top
C7  31.56,21.93 0 top
C8  43.26,110.93 180 top
C10  28.64,137.25 180 top
C14  28.57,143.22 180 top
C18  44.45,89.97 270 top
C19  44.5,93.06 180 top
C20  35.33,34.48 90 top
C21  56.91,24.34 180 top
C22  21.03,38.12 270 top
C23  25.23,66.89 270 top
C24  27.26,29.99 0 top
C25  29.33,95.62 270 top
C26  68.91,47.65 270 top
C27  64.78,84.54 270 top
C28  42.24,41.17 0 top
C29  36.72,21.86 180 top
C30  32.34,29.1 180 top
C31  55.07,122.45 180 top
C33  40.18,92.74 180 top
C40  32,122.12 0 top
C41  38.74,54.77 90 top
D_DRV  26.2,96.08 180 top
E1_DRV  26.48,26.68 270 top
E_DRV  65.57,47.94 180 top
G_DRV  22.1,67.18 180 top
H1_DRV  56.67,27.23 90 top
H1šWF  65.45,19.33 90 top
H_DRV  17.77,39.25 180 top
IC1  43.31,30.73 270 top
IC2  54.02,118.97 180 top
ICSP1  26.74,125.11 180 top
JP2  29.9,134.51 0 top
LED1  49.16,117.45 270 top
LED2  46.87,117.45 270 top
LED3  49.86,13.1 90 top
LED4  47.32,13.1 90 top
LED5  44.78,13.1 90 top
LED6  42.24,13.1 90 top
LED7  39.7,13.1 90 top
LED8  37.16,13.1 90 top
LED9  34.62,13.1 90 top
Q1  31.6,17.54 90 top
R1  46.15,51.34 180 top
R2  45.16,54.39 270 top
R3  38.65,60.84 90 top
R4  43.92,61.74 0 top
R5  43.94,63.86 0 top
R6  40.78,58.67 90 top
R7  33.14,130.17 180 top
R8  49.09,114.02 270 top
R9  46.97,114.02 270 top
R10  60.21,115.22 180 top
R11  33.14,128.13 0 top
R12  40.18,87.25 180 top
R13  40.17,94.88 0 top
R14  40.17,96.94 0 top
R15  49.86,9.8 270 top
R16  47.32,9.8 270 top
R17  44.78,9.8 270 top
R18  42.24,9.8 270 top
R19  39.7,9.8 270 top
R20  37.16,9.8 270 top
R21  34.62,9.8 270 top
SG1  44.74,76.25 90 top
SOT23-1  43.02,56.64 180 top
SW1  32.59,4.34 0 top
SW2  42.24,4.34 0 top
SW3  51.89,4.34 0 top
U1  43.57,107.14 180 top
U$1  19,19.32 270 top
U$2  32.62,104.81 270 top
U$3  29.35,75.77 270 top
U$4  58.72,56.68 90 top
U$6  54.37,93.5 90 top
U$7  24.72,47.18 270 top
U$8  40.22,90.02 180 top
U$27  28.65,140.13 270 top
U$28  33.1,125.11 90 top
X1  62.58,122.5 180 top

### Tracks (layer width: path | path; a pad name or v marks a point on that pad's centre or on a via)
10EN  (via drill 0.3)
  Top 0.254: JP2.P$2 29.9,131.87 v29.92,131.85 | IC1.55 44.67,29.97 v44.65,29.99 | v54.81,83.59 v54.81,80.54
  Bottom 0.254: v54.81,80.54 54.81,70.76 50.37,66.31 50.37,35.83 44.65,30.12 v44.65,29.99 | v29.92,131.85 40.46,131.85 46.3,126 46.3,88.28 50.11,84.47 53.92,84.47 v54.81,83.59
+3.15
  Top 0.254: 31.92,127.75 R11.1
  Top 0.699: U$28.P$2 31.83,127.66 R11.1
+3.15V  (via drill 0.3)
  Top 0.254: SOT23-1.5 42.69,52.79 42.69,52.03 42.3,51.65 | U$8.4 42.89,91 42.94,90.95 | U$8.4 43.55,92.13 C19.2 43.55,95.08 R14.2 | C30.1 34.6,29.97 IC1.26 42.02,29.97 42.07,29.93 | 42.56,30.99 42.55,31 IC1.10 42.55,39.46 C28.1 40.84,41.8 v42.3,43.26 | IC1.57 42.56,30.99 | 42.56,30.99 42.54,30.99 42.07,30.52 42.07,29.93 | 42.07,29.93 IC1.38 42.07,24.23 41.86,24.02 40.42,24.02 | IC1.35 40.57,24.17 40.42,24.02 | 42.3,51.65 40.27,51.65 39.13,52.79 39.13,52.98 C41.1 38.74,53.43 37.22,54.95 37.22,59.96 | v42.3,49.93 42.3,51.65 | v41.1,66.57 37.22,62.69 37.22,59.96 | v41.1,84.73 41.1,87.21 R12.1 40.97,87.41 v40.97,89.05 | U$8.1 41.23,89.05 | 41.23,89.05 v40.97,89.05 | U$8.4 41.14,91 41.14,91.03 v40.97,91.21 | 41.23,89.05 v40.97,89.05 | R3.1 37.3,59.89 37.22,59.96 | 40.42,24.02 38.75,22.36 C29.1
  Bottom 0.254: v42.3,43.26 v42.3,49.93 | v41.1,66.57 v41.1,84.73 | v40.97,91.21 v40.97,89.05
+5V  (via drill 0.3)  (1 unrouted)
  Top 0.254: R9.2 R8.2 49.11,113.05 49.73,113.05 51.27,114.58 | 51.27,115.6 51.26,115.59 v55.07,115.59 | C31.1 56.85,122.83 56.72,122.83 v55.07,124.48
  Top 0.508: X1.1 56.79,120.9 IC2.4
  Top 0.699: 56.79,120.9 56.79,122.13 C31.1
  Bottom 0.254: v55.07,124.48 v55.07,115.59
+10V  (via drill 0.3)
  Top 0.254: 57.67,25.99 H1_DRV.1 58.06,25.98 58.31,25.74 C21.1 | H_DRV.1 19.59,40.2 20.27,39.52 C22.1 | G_DRV.1 25.71,68.13 C23.1 | E1_DRV.1 25.53,29.29 C24.1 | E_DRV.1 68.5,48.89 C26.1 | A_DRV.1 64.5,85.84 C27.1 64.47,86.26 v64.47,88.16 | D_DRV.1 29.06,97.03 C25.1 | E_DRV.1 68.38,48.89 68.53,49.04 | E_DRV.1 68.42,48.89 68.53,48.79
  Top 0.699: JP2.P$3 32.6,134.5 v41.1,126 | C22.1 | C22.1 21.16,39.64 | v21.54,29.23 25.47,29.23 C24.1 | 68.53,49.04 v68.53,51.33 68.53,48.79 | v60.66,24.91 58.25,24.91 C21.1 | 64.47,85.88 C27.1 | v31.32,39.39 21.16,39.39 C22.1 | v34.37,67.46 33.73,68.09 25.81,68.09 C23.1 | C25.1 36.81,97.02 v37.67,96.16
  Bottom 0.699: v41.1,126 41.1,100.22 39.07,98.19 39.07,96.16 | v60.66,24.91 68.53,32.79 v68.53,51.33 67.26,52.6 67.26,60.47 58.24,69.49 58.24,81.94 | 39.07,86 39.07,72.16 v34.37,67.46 34.37,42.44 v31.32,39.39 21.54,29.61 v21.54,29.23 | 39.07,86 44.15,86 48.21,81.94 58.24,81.94 | 39.07,96.16 39.07,86 | v64.47,88.16 59.39,88.16 58.24,87.02 58.24,81.94 | v37.67,96.16 39.07,96.16
A_AIN1
  Top 0.254: IC1.62 50.42,33.48 51.64,34.69 51.64,68.28 61.85,78.49 A_DRV.10
A_AIN2
  Top 0.254: IC1.63 50.17,33.98 51.13,34.95 51.13,68.47 61.35,78.69 A_DRV.9
A_BIN1
  Top 0.254: IC1.64 49.92,34.49 50.62,35.2 50.62,68.66 60.85,78.89 A_DRV.8
A_BIN2
  Top 0.254: A_DRV.7 60.35,79.09 50.11,68.85 50.11,37.23 49.23,36.35 IC1.1 47.07,35.77
AN_IN  (via drill 0.3)
  Top 0.254: SOT23-1.1 44.92,55.4 44.97,55.46 44.4,55.46 | 44.27,55.46 44.4,55.46 | 44.4,55.46 44.46,55.52 v44.46,57.23 | IC1.16 39.55,35.45 39.87,35.14 40.78,35.14 v41.03,34.88
  Top 0.406: SOT23-1.1 45.09,55.4 R2.1 C4.1
  Bottom 0.254: v41.03,34.88 41.03,53.8 v44.46,57.23
CH_EN  (1 unrouted)
D_AIN1
  Top 0.254: IC1.2 46.56,42.94 36.72,52.79 36.72,82.83 26.45,93.1 D_DRV.10
D_AIN2
  Top 0.254: D_DRV.9 25.95,92.84 36.21,82.58 36.21,52.6 46.05,42.75 IC1.3
D_BIN1
  Top 0.254: IC1.4 45.57,42.54 35.7,52.41 35.7,82.33 25.45,92.58 D_DRV.8
D_BIN2
  Top 0.254: D_DRV.7 24.95,92.31 35.19,82.07 35.19,52.22 45.06,42.34 IC1.5
DIFF_NS  (via drill 0.3)
  Top 0.254: X1.2 59.33,121.7 57.38,123.65 57.38,124.48 v57,124.48 | IC1.36 41.05,26.03 40.11,26.98 40.11,28.82 v39.84,29.09 | v55.73,78.12 56.11,78.12 56.11,85.14 v55.73,84.75
  Bottom 0.254: v39.84,29.09 40.11,28.82 46.21,28.82 51.92,34.53 51.92,66.66 56.11,70.85 56.11,78.12 v55.73,78.12 | v55.73,84.75 56.11,85.14 50.66,85.14 46.97,88.83 46.97,103.87 57.38,114.29 57.38,124.48 v57,124.48
DIFF_PD  (via drill 0.3)
  Top 0.254: X1.3 59.18,122.5 57.84,123.84 57.84,124.48 v58.22,124.48 | IC1.37 41.56,26.17 40.56,27.17 40.56,28.37 v40.95,27.98 | v56.95,78.12 56.57,78.12 56.57,85.59 v56.84,85.86
  Bottom 0.254: v40.95,27.98 40.56,28.37 46.4,28.37 52.38,34.34 52.38,66.47 56.57,70.66 56.57,78.12 v56.95,78.12 | v56.84,85.86 56.57,85.59 50.84,85.59 47.42,89.02 47.42,103.68 57.84,114.1 57.84,124.48 v58.22,124.48
DRV_VCC  (via drill 0.3)
  Top 0.254: U1.5 51.35,105.84 60.02,97.17 v60.02,87.02 | A_DRV.11 62.35,83.29 v62.69,82.95 62.69,74.19 v57.23,68.73 | E_DRV.11 66.32,46.43 v66.75,45.99 64.47,43.71 v64.47,42.95 | H1_DRV.11 54.1,26.48 v53.8,26.18 | U1.5 44.52,105.68 | D_DRV.11 26.95,93.54 28.14,92.35 v35.64,92.35 | U1.5 44.52,106.58 44.02,107.08 40.34,107.08 v39.83,106.57 | G_DRV.11 22.85,64.62 24.59,62.89 v31.45,62.89 | H_DRV.11 18.52,36.82 20.14,35.2 v22.81,35.2 | v28.91,27.83 28.5,27.43 E1_DRV.11
  Bottom 0.254: v60.02,87.02 62.69,84.35 v62.69,82.95 | v66.75,45.99 66.75,50.19 65.99,50.95 65.99,59.96 v57.23,68.73 | v53.8,26.18 53.8,32.28 v64.47,42.95 | v39.83,106.57 39.83,102 35.64,97.81 v35.64,92.35 35.64,72.41 31.45,68.22 v31.45,62.89 31.45,43.84 v22.81,35.2 20.27,32.66 20.27,29.23 21.67,27.83 v28.91,27.83
DRV_WK  (via drill 0.3)
  Top 0.254: 35.64,29.48 v35.38,29.23 35.64,29.49 IC1.27
  Top 0.256: U1.3 42.53,108.35 v39.83,108.35
  Bottom 0.254: v39.83,108.35 37.16,108.35 34.49,110.89 30.56,110.89 27.38,107.72 27.38,82.95 22.94,78.51 22.94,54.76 17.48,49.3 17.48,31.26 21.92,26.82 32.97,26.82 v35.38,29.23
E1_AIN1
  Top 0.254: E1_DRV.10 34.16,26.93 36.21,28.98 IC1.28
E1_AIN2
  Top 0.254: E1_DRV.9 34.36,26.43 36.4,28.47 IC1.29
E1_BIN1
  Top 0.254: E1_DRV.8 34.56,25.93 36.11,27.48 IC1.31
E1_BIN2
  Top 0.254: E1_DRV.7 34.76,25.43 36.3,26.97 IC1.32
E_AIN1
  Top 0.254: IC1.58 51.49,31.5 65.82,45.82 E_DRV.10
E_AIN2
  Top 0.254: IC1.59 51.21,31.98 65.32,46.09 E_DRV.9
E_BIN1
  Top 0.254: IC1.60 50.96,32.48 64.82,46.35 E_DRV.8
E_BIN2
  Top 0.254: IC1.61 50.77,32.99 64.32,46.55 E_DRV.7
FGH  (via drill 0.3)
  Top 0.254: v24.21,122.97 v24.2,122.98 ICSP1.P$3
  Top 0.256: v40.84,33.17 40.84,33.68 40.03,34.49 IC1.17
  Bottom 0.256: v24.21,122.97 29.67,117.52 29.64,111.48 26.34,108.18 26.36,83.44 21.92,78.99 21.92,55.24 16.33,49.66 16.33,30.9 21.43,25.8 33.84,25.8 39.37,31.34 40.28,31.34 40.84,31.9 v40.84,33.17
G_AIN1
  Top 0.254: IC1.12 41.56,37.98 32.34,47.2 32.34,52.66 22.37,62.63 G_DRV.10
G_AIN2
  Top 0.254: G_DRV.9 21.87,62.74 | 21.87,62.74 21.87,62.43 | IC1.13 41.05,37.72 31.83,46.95 31.83,52.47 21.87,62.43 21.87,62.74
G_BIN1
  Top 0.254: G_DRV.8 21.37,62.23 31.32,52.28 31.32,46.69 40.57,37.44 IC1.14
G_BIN2
  Top 0.254: G_DRV.7 20.87,62.03 30.81,52.09 30.81,46.44 40.06,37.19 IC1.15
GFD  (via drill 0.3)
  Top 0.254: v26.75,122.96 v26.74,122.96 ICSP1.P$2
  Top 0.256: IC1.18 38.76,33.98 39.45,33.29 v39.45,32.66
  Bottom 0.254: 26.75,121.16 v26.75,122.96
  Bottom 0.256: 26.75,121.16 30.18,117.73 30.18,111.29 26.88,107.99 26.88,83.23 22.43,78.78 22.43,55.03 16.84,49.44 16.84,31.11 21.65,26.31 33.63,26.31 39.45,32.13 v39.45,32.66
GND  (via drill 0.3)  (54 unrouted)
  Top 0.254: Q1.2 32.8,21.77 | 32.8,21.77 C7.2 35.88,21.93 | 41.13,95.21 R13.2 41.13,94.87 | 55.83,24.79 55.83,24.66 C21.2 55.57,24.28 56.85,24.28 56.97,24.4 | 19.39,39 19.64,38.76 19.64,38.12 C22.2 | R20.2 R19.2 R18.2 R17.2 | R17.2 R16.2 47.32,6.75 48.14,5.93 SW3.1 47.89,4.34 | R15.2 47.77,8.85 | R17.2 R20.2 | 44.87,59.99 44.87,59.63 44.87,59.29 41.75,56.17 SOT23-1.2 41.75,54.77 41.29,54.31 40.27,54.31 | 44.87,59.99 44.97,60.09 | v43.58,26.82 v43.57,26.81 IC1.41 | 32.8,21.77 32.8,22.27 32.84,22.31 | X1.M1 X1.M4 60.33,126.45 X1.5 | X1.M2 X1.M3 60.24,118.64 59.89,118.64 60.15,118.38 61.16,118.38 61.42,118.13 61.16,117.87 R10.1 | v28.21,23.83 27.45,23.83 26.73,24.55 26.72,24.53 26.24,24.53 26.23,24.54 | 43.64,108.51 U1.2 43.58,109.22 C8.2 | C10.2 27.24,137.35 27.32,137.43 | 54.81,30.27 C5.1 56.1,30.23 56.42,29.91 | C40.1 31.15,121.64 | C33.1 40.21,91.69 40.21,90.7 40.56,90.35 U$8.3 43.29,90.35 43.86,90.92 C18.1 44.94,90.92 45.8,90.06 45.8,87.14 44.78,86.13 44.78,76.3 SG1.P$2 44.74,68.81 43.89,67.97 40.84,67.97 v38.69,65.81 | v38.69,58.06 38.69,56.23 C41.2 38.74,54.81 38.69,54.76 39.83,54.76 40.34,54.25 41.35,54.25 41.73,54.63 41.73,55.39 | 35.76,21.16 C29.2 35.88,21.93 | 35.88,21.93 35.26,22.56 v35.26,23.83 | 36.34,5.93 37.16,6.75 R20.2 | 33.41,8.85 30.36,11.9 C6.2 30.36,15.3 Q1.4 | 56.92,27.48 H1_DRV.PAD | 56.42,27.48 H1_DRV.PAD | E_DRV.6 64.32,48.29 | A_DRV.6 60.35,85.24 | A_DRV.PAD 61.29,84.89 61.04,85.14 | 61.35,84.64 A_DRV.PAD | 65.32,47.69 E_DRV.PAD 65.82,47.69 65.99,47.69 66.49,48.19 | 18.02,39.5 H_DRV.PAD | 18.02,39 H_DRV.PAD | 17.52,39.5 H_DRV.PAD | 17.52,39 H_DRV.PAD | H_DRV.6 16.52,39.6 | 26.73,26.93 E1_DRV.PAD
  Top 0.254: 26.23,26.93 E1_DRV.PAD | 26.23,26.43 E1_DRV.PAD | E1_DRV.6 26.13,25.43 | 22.35,67.43 G_DRV.PAD | 22.35,66.93 G_DRV.PAD | 21.85,66.93 G_DRV.PAD | D_DRV.6 24.95,96.43 | 26.45,96.33 D_DRV.PAD | 25.95,96.33 D_DRV.PAD | 25.95,95.83 D_DRV.PAD | 26.45,95.83 D_DRV.PAD | G_DRV.6 20.85,67.53 | 21.79,67.33 21.85,67.39 21.85,67.43 G_DRV.PAD | 61.85,84.64 A_DRV.PAD | H1_DRV.PAD 56.67,27.53 56.91,27.77 56.91,29.42 56.47,29.87 | H1_DRV.6 56.92,28.48 | H1_DRV.PAD 56.92,27.23 | 24.98,66.93 25.1,66.82 25.1,65.49 C23.2 | C25.2 29.2,95.61 28.98,95.83 27.85,95.83 | 64.68,84.64 64.78,84.54 C27.2 64.78,81.74 64.59,81.55 64.59,80.6 v64.53,80.54 | 26.73,28.33 26.75,28.6 27.13,28.98 27.26,29.99 C24.2 28.53,29.23 30.81,29.23 C30.2 30.94,30.37 31.04,30.48 37.02,30.48 37.03,30.47 39.64,30.47 39.7,30.53 | 44.87,59.99 44.87,60.51 | 44.87,60.51 44.87,61.7 44.91,61.74 44.91,61.61 | C28.2 43.64,38.44 43.07,37.87 43.07,37.3 43.06,37.29 43.06,35.37 43.29,35.14 | C3.2 44.87,60.51
  Top 0.406: R5.2 44.89,61.76 R4.2 | 44.87,59.63 C1.1
  Top 0.508: IC2.3 59.27,119.61 X1.M3
  Top 0.699: IC2.3 53.85,119.61 | v37.03,94.25 v32.84,94.25 29.11,94.25 C25.2 | v32.72,65.3 v28.91,65.3 25.8,65.3 C23.2 | C22.2 21.16,36.6 v22.94,36.6 v26.11,36.6 | C26.2 68.53,45.99 | v53.54,24.4 55.45,24.4 C21.2 | v57.86,66.57 64.53,73.23 v64.53,80.54 | C40.1 29.28,124 ICSP1.P$1 29.28,127.66 27.36,129.58 JP2.P$1 27.32,134.54 27.32,137.43 27.32,140.08 U$27.P$1 27.32,140.19 27.32,143.07 C14.2 27.17,144.34 28.4,145.56 31.19,145.56 53.67,123.09 C31.2 53.67,119.78 | 31.15,121.64 31.15,118.17 38.56,110.76 | C8.2 38.72,110.93 38.56,110.76 | C18.1 45.45,91.92 C19.1 45.42,93.09 45.42,100.86 | 38.56,110.76 v38.56,105.94 38.56,105.81 39.95,104.41 v39.95,100.86 45.42,100.86 | v21.03,31.52 27.26,31.52 28.15,30.62 C24.2 | R13.2 41.12,92.75 C33.1 | v50.5,100.86 45.42,100.86
  Bottom 0.254: v43.58,26.82 39.57,26.82 36.59,23.83 v35.26,23.83 v28.21,23.83 | v43.57,26.81 45.97,24.4 v53.54,24.4 | v38.69,58.06 v38.69,65.81
  Bottom 0.699: v53.54,24.4 66.5,37.36 v66.5,43.96 64.98,45.48 64.98,59.45 v57.86,66.57 | v64.53,80.54 65.74,81.74 65.74,91.71 56.59,100.86 v50.5,100.86 | v21.03,31.52 v26.11,36.6 32.72,43.2 v32.72,65.3 32.72,67.97 37.03,72.28 v37.03,94.25 36.53,94.76 36.53,97.43 v39.95,100.86
  pour Top (isolate 0.254): 0.08,5.23 10.11,37.48 14.55,58.19 18.24,87.9 20.14,147.21 35.13,147.21 44.53,135.4 53.67,130.7 56.97,129.69 59.26,129.18 67.51,129.18 67.13,107.84 67.64,85.24 69.55,64.92 70.94,54.76 72.97,43.58 74.12,38.25 77.17,26.56 83.52,6.12 67.64,0.15 21.67,0.15
  pour Bottom (isolate 0.381): 0.08,5.23 10.11,37.48 14.55,58.19 18.24,87.9 20.14,147.21 35.13,147.21 44.53,135.4 53.67,130.7 56.97,129.69 59.26,129.18 67.51,129.18 67.13,107.84 67.64,85.24 69.55,64.92 70.94,54.76 72.97,43.58 74.12,38.25 77.17,26.56 83.52,6.12 67.64,0.15 21.67,0.15
H1_AIN1
  Top 0.254: H1_DRV.10 48.93,26.98 IC1.49
H1_AIN2
  Top 0.254: H1_DRV.9 IC1.50 | IC1.50
H1_BIN1
  Top 0.254: IC1.51 H1_DRV.8
H1_BIN2
  Top 0.254: IC1.52 55.71,28.47 H1_DRV.7
H_AIN1
  Top 0.254: H_DRV.10 18.02,36.37 20.08,34.31 30.3,34.31 32.13,32.48 IC1.21
H_AIN2
  Top 0.254: H_DRV.9 17.52,36.1 19.83,33.8 30.05,33.8 31.87,31.98 IC1.22
H_BIN1
  Top 0.254: H_DRV.8 17.02,35.84 19.57,33.29 29.8,33.29 31.59,31.5 IC1.23
H_BIN2
  Top 0.254: H_DRV.7 16.52,35.64 19.38,32.79 29.54,32.79 31.34,30.99 IC1.24
N$3
  Top 0.254: IC1.19 36.73,33.48 36.53,33.68 36.53,34.37 35.53,35.37 C20.2
N$4
  Top 0.254: C20.1 35.84,33.53 36.38,32.99 IC1.20
N$5  (via drill 0.3)
  Top 0.254: 32.19,130.07 R7.2 31.76,130.7 v30.94,130.7 | v44.65,33.55 44.07,34.13 IC1.7 | v53.04,83.59 v53.04,80.54
  Bottom 0.254: v30.94,130.7 40.97,130.7 45.67,125.75 45.67,87.9 49.99,83.59 v53.04,83.59 | v44.65,33.55 48.46,37.36 48.46,67.33 53.04,71.9 v53.04,80.54
N$6
  Top 0.254: IC1.56 51.97,30.48 C5.2
N$7
  Top 0.254: U$2.L2B 25.8,114.86 27.44,113.22 27.44,111.77 26.95,111.27 D_DRV.2
N$8
  Top 0.254: U$2.L2A 26.45,112.05 D_DRV.3
N$9
  Top 0.254: U$2.L1B 22.31,112.19 22.31,110.42 25.45,107.28 D_DRV.5
N$10
  Top 0.254: U$2.L1A 25.95,109.1 D_DRV.4
N$11
  Top 0.254: LED3.A 47.07,16.64 IC1.48
N$12
  Top 0.254: SOT23-1.4 41.18,52.8 42.18,53.8 44.79,53.8 R2.2 45.16,51.38 R1.2
  Top 0.406: R2.2 C4.2
N$13
  Top 0.254: R1.1 47.71,51.34 48.59,52.22 48.59,56.17 C3.1
N$14
  Top 0.254: 40.76,60.39 40.78,60.38 | 39.07,62 39.07,61.74 38.99,61.67 R3.2 38.79,61.81 C2.2
  Top 0.406: R6.2 40.78,60.38 C2.2 42.9,61.81 R4.1
N$15
  Top 0.254: IC2.7 49.29,118.33 LED1.C
N$16
  Top 0.254: R5.1 42.99,64.34 SG1.P$1
  Top 0.406: C2.1 42.84,63.71 R5.1
N$17
  Top 0.254: E1_DRV.2 14.07,27.43 12.33,29.17 11.97,29.17 U$1.L2B
N$18
  Top 0.254: E1_DRV.3 12.46,26.93 U$1.L2A
N$19
  Top 0.254: E1_DRV.4 15.82,26.43 14.75,25.36 10.58,25.36 U$1.L1A
N$20
  Top 0.254: E1_DRV.5 16.65,25.93 14.68,23.96 9.54,23.96 8.46,25.04 8.46,26.46 U$1.L1B
N$21
  Top 0.254: IC2.6 48.28,119.61 LED2.C
N$22
  Top 0.254: LED2.A 46.87,115.06 R9.1
N$23
  Top 0.254: LED1.A 49.16,115.03 R8.1
N$24
  Top 0.254: IC2.2 57.91,118.33 58.62,117.62 58.62,115.85 R10.2 59.26,115.47 58.88,115.84
N$25
  Top 0.406: SOT23-1.3 40.8,57.71 R6.1 41.53,57.73 42.69,58.88 42.69,59.32 C1.2
N$26
  Top 0.254: R12.2 39.23,88.82 39,89.05 U$8.8
N$27
  Top 0.254: 22.36,85.82 U$3.L2B 22.3,85.64 22.63,85.64 24.09,84.18 24.09,82.89 22.85,81.64 G_DRV.2
N$28
  Top 0.254: G_DRV.3 22.35,83.3 U$3.L2A
N$29
  Top 0.254: G_DRV.5 21.35,79.03 18.98,81.39 18.98,83.08 U$3.L1B
N$30
  Top 0.254: G_DRV.4 21.85,80.89 U$3.L1A
N$31
  Top 0.254: U$8.6 38.91,90.35 39.26,90.7 39.26,93.03 C33.2
N$32
  Top 0.254: LED4.A 46.56,14.61 IC1.47
N$33
  Top 0.254: U$8.5 38.02,93.68 R13.1 R14.1
N$34
  Top 0.254: LED5.A 46.05,15.13 IC1.46
N$35
  Top 0.254: E_DRV.5 64.82,62.66 63.96,63.52 63.96,65.3 65.23,66.57 65.78,66.57 U$4.L2B
N$36
  Top 0.254: H_DRV.4 17.52,52 U$7.L1A
N$37
  Top 0.254: E_DRV.2 66.32,59.53 68.91,62.12 68.91,64.17 U$4.L1B
N$38
  Top 0.254: E_DRV.3 65.82,61.4 U$4.L1A
N$40
  Top 0.254: E_DRV.4 65.32,64.17 U$4.L2A
N$41
  Top 0.254: A_DRV.5 60.85,99.14 59.39,100.6 59.39,101.87 60.91,103.4 61.44,103.4 U$6.L2B
N$42
  Top 0.254: LED6.A 45.57,17.18 IC1.45
N$43
  Top 0.254: LED7.A 45.06,19.21 IC1.44
N$44
  Top 0.254: LED8.A 44.56,21.25 IC1.43
N$45
  Top 0.254: IC1.42 44.07,22.94 34.99,13.85 LED9.A
N$46
  Top 0.254: LED9.C R21.1
N$47  (1 unrouted)
  Top 0.254: H1_DRV.2 69.54,26.48 72.1,23.92 74.8,23.92 75.81,24.94 75.81,26.61 74.44,27.98
N$48
  Top 0.254: H1_DRV.3 69.96,26.97 71.26,25.67 H1šWF.L1A
N$49
  Top 0.254: H1_DRV.5 70.46,27.98 71.86,29.38 H1šWF.L2B
N$50
  Top 0.254: H1_DRV.4 71.58,27.48 H1šWF.L2A
N$51
  Top 0.254: LED8.C R20.1
N$52
  Top 0.254: LED7.C R19.1
N$53
  Top 0.254: LED6.C R18.1
N$54
  Top 0.254: LED5.C R17.1
N$55
  Top 0.254: LED4.C R16.1
N$56
  Top 0.254: LED3.C R15.1
N$57
  Top 0.254: A_DRV.2 62.35,96.79 64.72,99.17 64.72,100.83 U$6.L1B
N$58
  Top 0.254: A_DRV.3 61.85,98.6 U$6.L1A
N$60
  Top 0.254: A_DRV.4 61.35,97.56 61.35,98.01 61.35,101.06 U$6.L2A
N$62
  Top 0.254: IC1.30 38.66,27.99 38.94,27.71 38.94,26.69 38.69,26.44 36.53,26.44 35,24.91 30.56,24.91 28.84,23.19 SW1.1
N$67
  Top 0.254: H_DRV.2 18.52,52.95 19.77,54.2 19.77,55.56 18.09,57.23 16.99,57.23 U$7.L2B
N$68
  Top 0.254: H_DRV.3 18.02,54.45 U$7.L2A
N$69
  Top 0.254: H_DRV.5 17.02,50.09 14.62,52.49 14.62,54.19 15.7,55.27 U$7.L1B
OSC1  (1 unrouted)
  Top 0.254: 43.06,23.75 36.62,17.32 31.7,17.32 31.7,16.66 32.46,15.9 32.46,15.68 Q1.1 32.51,15.06 32.51,13.42 C6.1
OSC2  (1 unrouted)
  Top 0.254: C7.1 30.61,19.96 | 30.61,19.96 Q1.3 | 42.55,24.02 36.3,17.78 31.7,17.78 30.61,18.86 30.61,19.96
RST
  Top 0.254: R7.1 R11.2
  Top 0.699: C40.2 34.37,123.64 U$28.P$1 34.37,127.75 R11.2
SW2
  Top 0.254: SW2.2 45.99,3.95 47.26,2.69 56.53,2.69 56.97,3.13 56.97,17.42 47.77,26.63 47.77,28.66 48.09,28.98 IC1.53
SW3
  Top 0.254: IC1.54 47.9,29.49 47.26,28.85 47.26,26.44 56.21,17.48 56.21,4.59 55.96,4.34 SW3.2
VBAT  (via drill 0.3)  (1 unrouted)
  Top 0.254: C18.2 43.78,89.7 U$8.2 U$8.7 | U1.1 44.52,110.79 C8.1
  Top 0.699: IC2.5 50.8,120.88 48.84,122.83 | 48.84,122.83 31.54,140.13 U$27.P$2 | 29.86,143.11 C14.1 29.92,143.17 U$27.P$2 | 29.88,137.4 C10.1 29.92,137.36 U$27.P$2 | 48.84,122.83 44.66,118.65 44.66,118.64 | 44.66,118.64 C8.1 | v42.88,87.14 44.45,88.72 C18.2 | v42.88,116.86 44.66,118.64
  Bottom 0.699: v42.88,87.14 v42.88,116.86

### Text on the board
tPlace: AutoTune guitar / Ver. 1.0 | Vojtech Jerabek